# EAGLE design SIO-XS v1p1 (EAGLE 9.6.2)
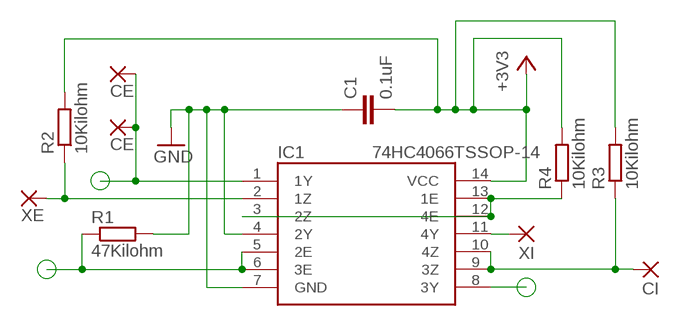
[diagram p0: schematic, sheet 1]

## Parts
C1  0.1uF  CAPACITORSC0805  [C0805]
CE  CE  PADSCIRCLE-1,5X1,5  [CIRCLE-1,5X1,5]
CE1  CE  PADSCIRCLE-1,5X1,5  [CIRCLE-1,5X1,5]
CI  CI  PADSCIRCLE-1,5X1,5  [CIRCLE-1,5X1,5]
IC1  74HC4066TSSOP-14  [TSSOP-14]
R1  47Kilohm  RESISTORSR0805  [R0805]
R2  10Kilohm  RESISTORSR0805  [R0805]
R3  10Kilohm  RESISTORSR0805  [R0805]
R4  10Kilohm  RESISTORSR0805  [R0805]
XE  XE  PADSCIRCLE-1,5X1,5  [CIRCLE-1,5X1,5]
XI  XI  PADSCIRCLE-1,5X1,5  [CIRCLE-1,5X1,5]

## Nets
+3.3V: C1.2 IC1.14(VCC) R2.2 R3.2 R4.2 ; supply symbol labelled +3V3
CE: CE1.1(P) CE.1(P) IC1.1(1Y)
CI: CI.1(P) IC1.9(3Z) IC1.10(4Z) R3.1
EN: IC1.5(2E) IC1.6(3E) R1.1
GND: C1.1 IC1.4(2Y) IC1.7(GND) R1.2
N$4: IC1.8(3Y)
N$10: IC1.3(2Z) IC1.12(4E) IC1.13(1E) R4.1
XE: IC1.2(1Z) R2.1 XE.1(P)
XI: IC1.11(4Y) XI.1(P)

## Library data of the parts
C1 = Consoles Unleashed Eagle Parts Library:CAPACITORS: Capacitors
CE CE1 CI XE XI = Consoles Unleashed Eagle Parts Library:PADS: PADS to connect wires to PCB
IC1 = Consoles Unleashed Eagle Parts Library:74HC4066: 74HC4066 quad SPST analog switch.
R1-R4 = Consoles Unleashed Eagle Parts Library:RESISTORS: Resistors

## Board
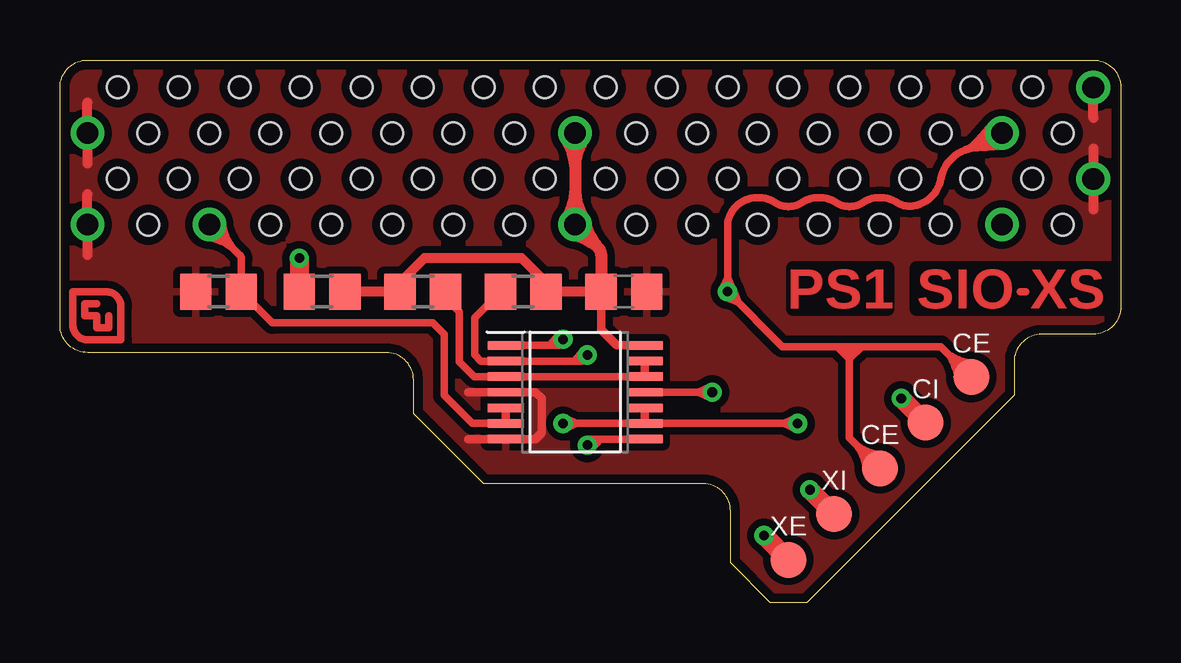
[diagram p1: board, top side]
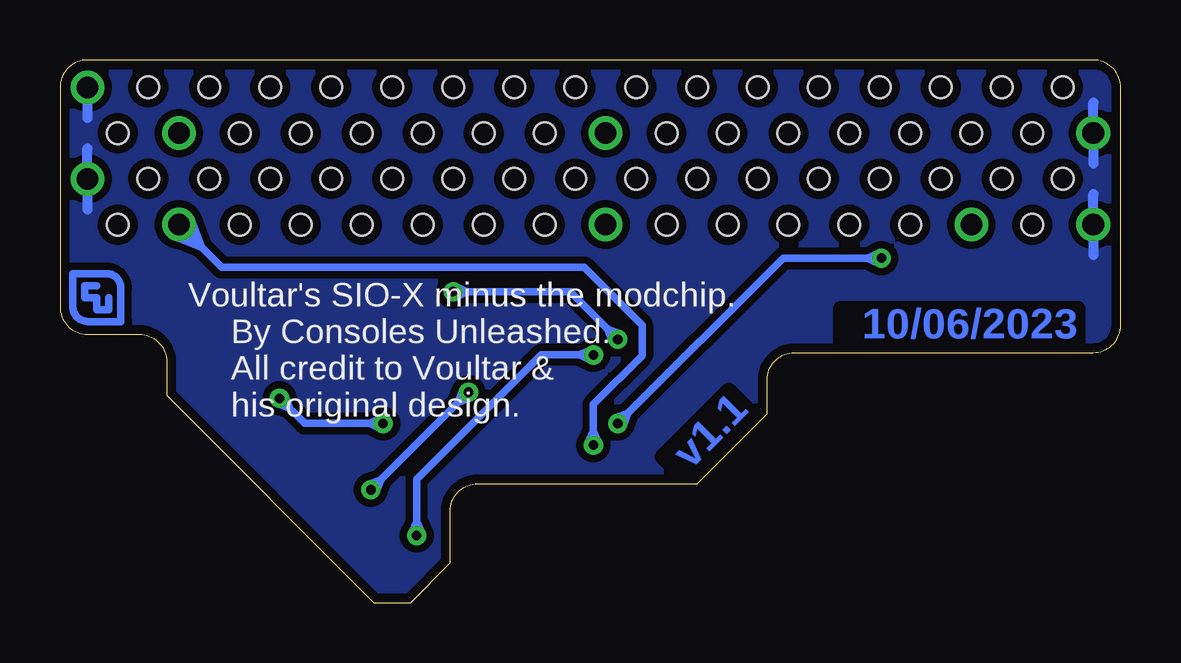
[diagram p2: board, bottom side, seen from below]

Size 44.2 x 22.61 mm. Coordinates in mm from the lower left corner, seen from the top.
Outline: 14.73,7.87 14.73,9.28 arc90 13.6,10.41 1.15,10.41 arc-90 0,11.56 0,14.6 0,21.46 arc-90 1.15,22.61 43.05,22.61 arc-90 44.2,21.46 44.2,12.32 arc-90 43.05,11.18 40.9,11.18 arc90 39.75,10.02 39.75,8.64 31.12,0 29.59,0 27.94,1.65 27.94,3.81 arc90 26.8,4.95 24.64,4.95 17.65,4.95 14.73,7.87
Copper layers (1*16): Top 0.035559375mm / dielectric 1.6mm / Bottom 0.035559375mm
Design rules "oshpark-2layer *": minimum track width 6mil, minimum drill 10mil, track to track 6mil, track to pad 6mil, pad to pad 6mil, via to via 6mil, smd to smd 6mil, copper to edge 15mil, drill to drill 6mil, minimum pad ring 5mil, minimum via ring 5mil, stop-mask expansion 2.5mil, vias tented up to drill 0.8mm, thermal gap 12mil
Holes 0.9 mm at 2.41,21.46 4.95,21.46 7.49,21.46 10.03,21.46 12.57,21.46 15.11,21.46 17.65,21.46 20.19,21.46 22.73,21.46 25.27,21.46 27.81,21.46 30.35,21.46 32.89,21.46 35.43,21.46 37.97,21.46 40.51,21.46 41.78,19.56 40.51,17.65 41.78,15.75 37.97,17.65 35.43,17.65 32.89,17.65 30.35,17.65 2.41,17.65 4.95,17.65 7.49,17.65 10.03,17.65 12.57,17.65 15.11,17.65 17.65,17.65 20.19,17.65 22.73,17.65 25.27,17.65 27.81,17.65 3.68,15.75 8.76,15.75 11.3,15.75 13.84,15.75 16.38,15.75 18.92,15.75 24,15.75 26.54,15.75 29.08,15.75 31.62,15.75 34.16,15.75 36.7,15.75 36.7,19.56 34.16,19.56 31.62,19.56 29.08,19.56 26.54,19.56 24,19.56 18.92,19.56 16.38,19.56 13.84,19.56 11.3,19.56 8.76,19.56 6.22,19.56 3.68,19.56

### Footprints (pad centres in the part's own frame; a part is rotated, then mirrored left to right if it is on the bottom)
C0805 = smd 1.3 x 1.5: 1 -0.95,0; 2 0.95,0
CIRCLE-1,5X1,5 = smd 1.5 x 1.5: 1 0,0
TSSOP-14 = smd 1.5 x 0.35: 1 -2.9,1.95; 2 -2.9,1.3; 3 -2.9,0.65; 4 -2.9,0; 5 -2.9,-0.65; 6 -2.9,-1.3; 7 -2.9,-1.95; 8 2.9,-1.95; 9 2.9,-1.3; 10 2.9,-0.65; 11 2.9,0; 12 2.9,0.65; 13 2.9,1.3; 14 2.9,1.95
R0805 = smd 1.3 x 1.5: 1 -0.95,0; 2 0.95,0

### Placement (x,y rotation side)
C1  23.5,12.95 180 top
CE  37.97,9.4 0 top
CE1  34.16,5.59 0 top
CI  36.07,7.49 0 top
IC1  21.46,8.76 0 top
R1  6.6,12.95 180 top
R2  19.3,12.95 0 top
R3  10.92,12.95 0 top
R4  15.11,12.95 180 top
XE  30.35,1.78 0 top
XI  32.26,3.68 0 top

### Tracks (layer width: path | path; a pad name or v marks a point on that pad's centre or on a via)
+3.3V  (via drill 0.9 pad 1.4)
  Top 0.35: C1.2 22.55,11.36 23.2,10.71 IC1.14
  Top 0.406: R3.2 R4.2 14.16,13.33 15.18,14.35 19.24,14.35 20.25,13.33 R2.2 C1.2
  Top 0.508: v21.46,15.75 22.42,14.79 arc-45 22.55,14.48 C1.2 | v21.46,19.56 v21.46,15.75 | v21.46,19.56 21.88,19.41 arc30 21.46,18.21 arc30 21.04,19.41 v21.46,19.56 | v21.46,15.75 21.87,15.94 arc30 22.42,14.79 arc30 21.27,15.35 v21.46,15.75 | v21.46,15.75 21.04,15.89 arc30 21.46,17.1 arc30 21.88,15.89 v21.46,15.75
AVOID1
  cutout Top: 0.13,19.56 arc90 1.14,18.54 arc90 2.16,19.56 arc90 1.14,20.57 arc90
  cutout Top: 0.13,15.75 arc90 1.14,14.73 arc90 2.16,15.75 arc90 1.14,16.76 arc90
  cutout Top: 42.04,21.46 arc90 43.05,20.45 arc90 44.07,21.46 arc90 43.05,22.48 arc90
  cutout Top: 42.04,17.65 arc90 43.05,16.64 arc90 44.07,17.65 arc90 43.05,18.67 arc90
  cutout Bottom: 0.13,19.56 arc90 1.14,18.54 arc90 2.16,19.56 arc90 1.14,20.57 arc90
  cutout Bottom: 0.13,15.75 arc90 1.14,14.73 arc90 2.16,15.75 arc90 1.14,16.76 arc90
  cutout Bottom: 42.04,21.46 arc90 43.05,20.45 arc90 44.07,21.46 arc90 43.05,22.48 arc90
  cutout Bottom: 42.04,17.65 arc90 43.05,16.64 arc90 44.07,17.65 arc90 43.05,18.67 arc90
CE  (via drill 0.4 pad 0.8, 0.9 pad 1.4)
  Top 0.305: 33.4,10.67 36.7,10.67 37.02,10.35 | 33.4,10.67 33.27,10.67 | 32.89,10.67 32.38,10.67 | 32.38,10.67 30.1,10.67 v27.81,12.95 | 37.02,10.35 CE.1 | v20.96,10.97 20.7,10.71 IC1.1 | v27.81,12.95 27.81,15.75 arc-51 28.32,16.64 arc-70 29.85,16.64 arc60 30.86,16.64 arc-70 32.38,16.64 arc60 33.4,16.64 arc-70 34.92,16.64 arc40 35.58,16.53 arc70 36.7,17.65 arc-70 37.97,18.92 | CE1.1 33.21,6.54 | 33.21,6.54 32.89,6.86 32.89,10.16 | 32.89,10.16 32.89,10.29 | 32.89,10.29 32.89,10.67 | 32.89,10.29 33.27,10.67 | 33.27,10.67 32.89,10.67 | 32.38,10.67 32.89,10.16 | 32.89,10.16 33.4,10.67 | v20.96,10.97 20.96,10.72 20.41,10.71 20.77,11.13 v20.96,10.97 | v27.81,12.95 28.05,13.04 28.24,12.53 27.73,12.72 v27.81,12.95 | v27.81,12.95 27.59,13.06 27.81,13.55 28.04,13.06 v27.81,12.95 | 37.97,18.92 38.6,18.97 39.28,19.01 v39.24,19.56 | 37.97,18.92 37.93,18.92 38.24,19.24 38.84,19.93 39.2,19.56 v39.24,19.56 | 37.72,18.86 37.95,18.97 38.11,18.97 38.28,19.05 v39.24,19.56 | v39.24,19.56 39.24,19.24 | 33.21,6.54 arc-30 33.6,5.5 34.25,6.15 arc-30 33.21,6.54 | 37.02,10.35 arc-30 37.41,9.31 38.06,9.96 arc-30 37.02,10.35
  Bottom 0.305: v27.81,12.95 22.94,12.95 v20.96,10.97 | v20.96,10.97 20.87,11.2 21.38,11.39 21.19,10.88 v20.96,10.97 | v27.81,12.95 27.71,12.73 27.21,12.95 27.71,13.18 v27.81,12.95
CI  (via drill 0.4 pad 0.8)
  Top 0.305: v20.96,7.46 IC1.9 v30.73,7.46 | v20.96,7.46 21.06,7.69 21.55,7.46 21.06,7.24 v20.96,7.46 | v30.73,7.46 30.63,7.24 30.13,7.46 30.63,7.69 v30.73,7.46
  Top 0.35: IC1.9 IC1.10
  Top 0.8: v9.97,14.35 R3.1 | CI.1 v35.05,8.51
  Bottom 0.305: v20.96,7.46 14.07,14.35 v9.97,14.35 | v35.05,8.51 34.01,7.46 v30.73,7.46 | v9.97,14.35 10.07,14.58 10.57,14.35 10.07,14.12 v9.97,14.35 | v20.96,7.46 20.72,7.38 20.53,7.89 21.04,7.7 v20.96,7.46 | v30.73,7.46 30.84,7.69 31.33,7.46 30.84,7.24 v30.73,7.46 | v35.05,8.51 35.14,8.28 34.63,8.08 34.82,8.6 v35.05,8.51
EN  (via drill 0.9 pad 1.4)
  Top 0.305: IC1.6 17.18,7.46 16,8.64 16,11.18 15.52,11.65 8.85,11.65 R1.1 7.55,14.33 arc45 7.49,14.48 v6.22,15.75 | v6.22,15.75 6.73,15.94 arc30 7.18,14.79 arc30 6.03,15.24 v6.22,15.75
  Top 0.35: IC1.6 IC1.5
GND  (via drill 0.9 pad 1.4)
  Top 0.35: 17.02,6.81 IC1.7 19.8,6.81 20.07,7.08 20.07,8.51 19.81,8.76 IC1.4 17.02,8.76
  Top 0.406: 43.05,20.19 v43.05,21.46 | 43.05,18.92 v43.05,17.65 43.05,16.38 | 1.14,20.83 v1.14,19.56 1.14,18.29 | 1.14,14.48 v1.14,15.75 1.14,17.02
  Bottom 0.406: 1.14,20.83 v1.14,19.56 1.14,18.29 | 1.14,17.02 v1.14,15.75 1.14,14.48 | v43.05,21.46 43.05,20.19 | 43.05,16.38 v43.05,17.65 43.05,18.92
  pour Top (isolate 0.305): -0.13,22.73 -0.13,-0.13 44.32,-0.13 44.32,22.73
  pour Bottom (isolate 0.305): -0.13,22.73 -0.13,-0.13 44.32,-0.13 44.32,22.73
LOGO
  Bottom 0.305: 42.66,13.21 43.16,13.21 43.16,12.71 42.66,12.71 42.66,12.21 42.16,12.21 42.16,12.71 | 43.66,13.71 43.66,12.33 arc-90 43.04,11.71 41.66,11.71 41.66,13.1 arc-90 42.27,13.71 43.66,13.71
LOGO2
  Top 0.305: 1.53,12.45 1.03,12.45 1.03,11.95 1.53,11.95 1.53,11.45 2.04,11.45 2.04,11.95 | 0.54,12.95 0.54,11.57 arc90 1.16,10.95 2.54,10.95 2.54,12.34 arc90 1.93,12.95 0.54,12.95
LOGO3
  Top 0.305: 40,12.95 40.23,12.95
N$4  (via drill 0.4 pad 0.8, 0.9 pad 1.4)
  Top 0.305: IC1.8 22.23,6.81 v21.97,6.56 | v21.97,6.56 21.97,6.81 22.52,6.81 22.16,6.4 v21.97,6.56
  Bottom 0.305: v39.24,15.75 37.46,13.97 22.35,13.97 19.94,11.56 19.94,10.29 21.97,8.25 v21.97,6.56 | v39.24,15.75 39.44,15.24 38.29,14.79 38.73,15.94 v39.24,15.75 | v21.97,6.56 21.75,6.66 21.97,7.16 22.2,6.66 v21.97,6.56
N$10
  Top 0.305: R4.1 16.06,12.7 16.64,12.13 16.64,10.03 17.26,9.41 IC1.3 IC1.12
  Top 0.35: IC1.12 IC1.13
XE  (via drill 0.4 pad 0.8)
  Top 0.305: v21.97,10.32 21.72,10.06 IC1.2 17.53,10.06 17.27,10.32 17.27,11.87 R2.1 | v21.97,10.32 21.97,10.07 21.43,10.06 21.78,10.48 v21.97,10.32
  Top 0.8: XE.1 v29.34,2.79
  Bottom 0.305: v29.34,2.79 29.34,5.13 24.15,10.32 v21.97,10.32 | v21.97,10.32 22.07,10.54 22.57,10.32 22.07,10.09 v21.97,10.32 | v29.34,2.79 29.11,2.9 29.34,3.39 29.56,2.9 v29.34,2.79
XI  (via drill 0.4 pad 0.8)
  Top 0.305: v27.18,8.76 IC1.11 | v27.18,8.76 27.08,8.54 26.58,8.76 27.08,8.99 v27.18,8.76
  Top 0.8: XI.1 v31.24,4.7
  Bottom 0.305: v31.24,4.7 v27.18,8.76 | v27.18,8.76 27.41,8.85 27.6,8.34 27.09,8.53 v27.18,8.76 | v31.24,4.7 31.01,4.61 30.82,5.12 31.33,4.93 v31.24,4.7

### Text on the board
Top: PS1 | SIO XS
Bottom: 10/06/2023 | v1.1
tNames: CE
bNames: Voultar's SIO-X minus the modchip. | By Consoles Unleashed. / All credit to Voultar & / his original design.
tStop: P | S | 1 | S | I | O | X | S
Reference: JLCJLCJLCJLC